# EAGLE design IO4-IR-Detector-Active-Mount (EAGLE 7.7.0)
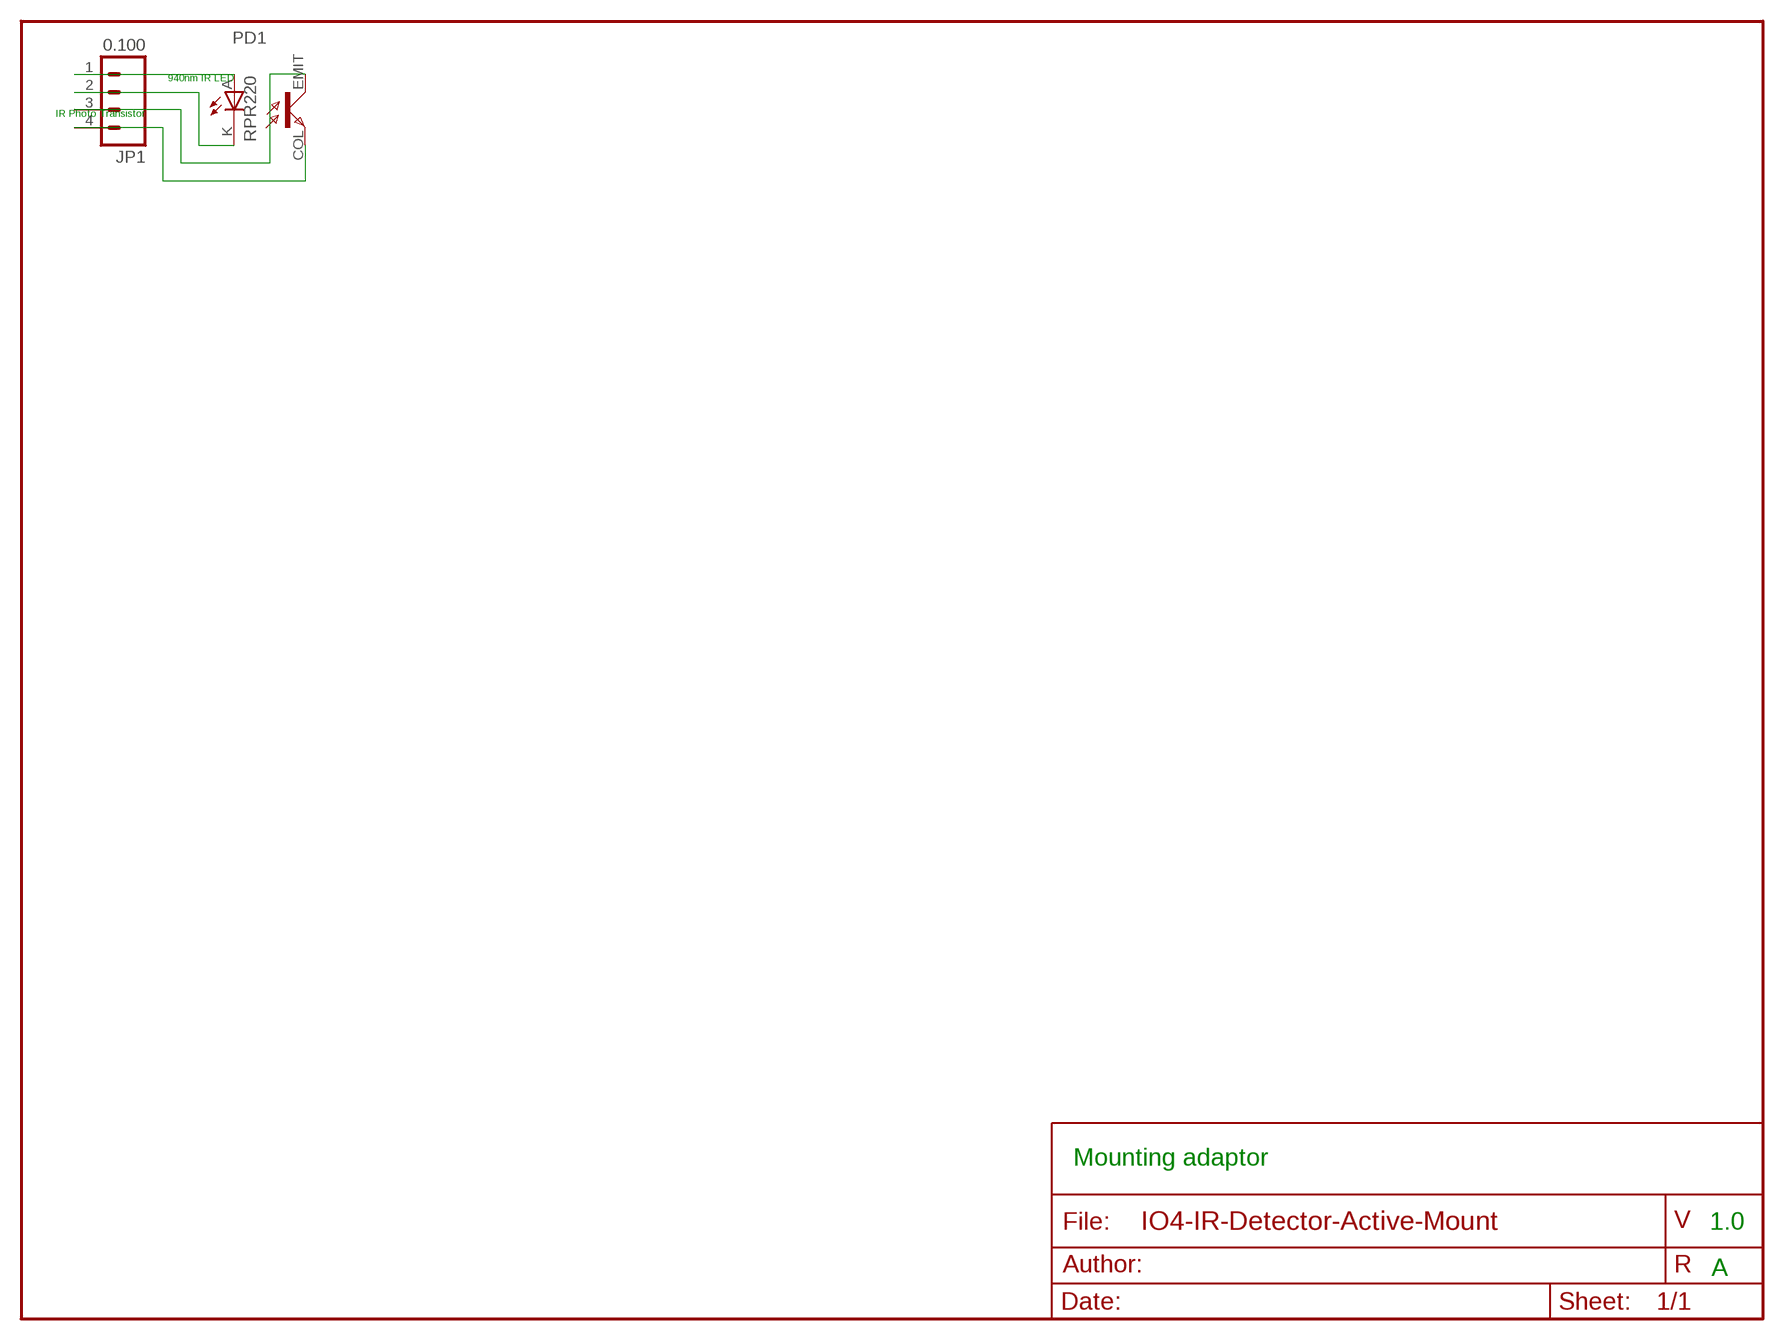
[diagram p0: schematic, sheet 1]

## Parts
JP1  0.100  CONNECTOR-M04LOCK  [1X04_LOCK]
PD1  RPR220  PHOTODETECTOR  [RPR220]

## Nets
N$1: JP1.2 PD1.K
N$2 [Power]: JP1.1 PD1.A
N$3: JP1.4 PD1.COL
N$4 [Power]: JP1.3 PD1.EMIT

## Notes on the sheet
- 940nm IR LED
- IR Photo Transistor
- Mounting adaptor
- 1.0
- A

## Library data of the parts
JP1 = SPCoast:CONNECTOR-M04: Header 4 Standard 4-pin 0.1" header. Use with straight break away headers (SKU : PRT-00116), right angle break away headers (PRT-00553), swiss pins (PRT-00743), machine pins (PRT-00117), and female headers (PRT-00115). Molex polarized connector foot print use with SKU : PRT-08231 with associated crimp pins and housings. 1MM SMD Version SKU: PRT-10208
PD1 = SPCoast:PHOTODETECTOR

## Net classes
0 default: width 0.254 mm
1 Power: width 0.406 mm, clearance 0.254 mm

## Board
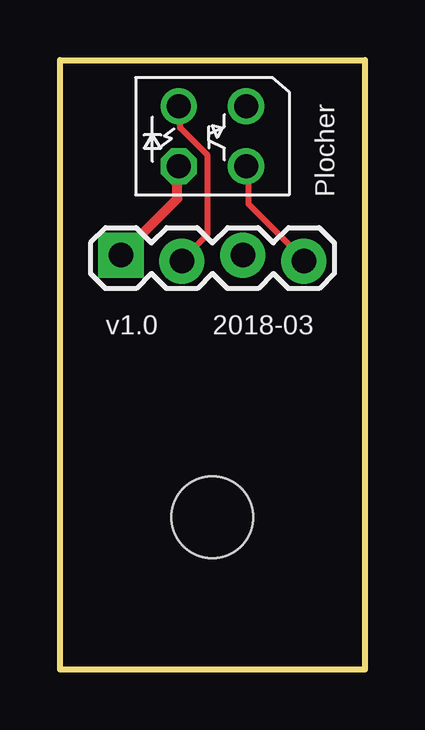
[diagram p1: board, top side]
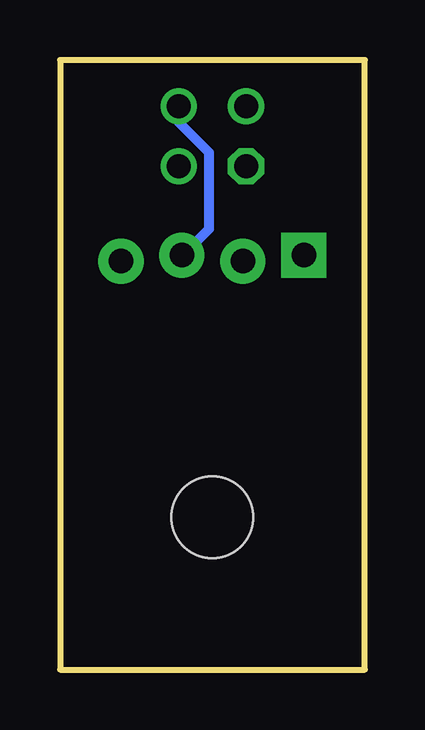
[diagram p2: board, bottom side, seen from below]

Size 12.7 x 25.4 mm. Coordinates in mm from the lower left corner, seen from the top.
Outline: 0,0 0,25.4 12.7,25.4 12.7,0 0,0
Copper layers (1*16): Top 0.035mm / dielectric 1.5mm / Bottom 0.035mm
Design rules "default": minimum track width 10mil, minimum drill 0.6mm, track to track 8mil, track to pad 8mil, pad to pad 8mil, via to via 8mil, smd to smd 8mil, copper to edge 40mil, drill to drill 8mil, minimum pad ring 10mil, minimum via ring 8mil, stop-mask expansion 4mil, vias tented up to drill 0mil, thermal gap 10mil
Holes 3.4 mm at 6.35,6.35

### Footprints (pad centres in the part's own frame; a part is rotated, then mirrored left to right if it is on the bottom)
1X04_LOCK = drill 1.016 pad 1.88 square: 1 0,0.127 | drill 1.016 pad 1.88: 2 2.54,-0.127; 3 5.08,0.127; 4 7.62,-0.127
RPR220 = drill 1 octagon: A -1.4,-1.25 | drill 1: COL 1.4,-1.25; EMIT 1.4,1.25; K -1.4,1.25

### Placement (x,y rotation side)
JP1  2.54,17.14 0 top
PD1  6.35,22.23 0 top

### Tracks (layer width: path | path; a pad name or v marks a point on that pad's centre or on a via)
N$1
  Top 0.254: PD1.K 5,23.37 5,22.57 6.15,21.43 6.15,18.14 5.12,17.11 JP1.2
N$2
  Top 0.406: JP1.1 4.89,19.62 4.89,20.97 PD1.A
N$3
  Top 0.254: PD1.COL 7.86,20.97 7.86,19.39 10.15,17.11 JP1.4
N$4
  Bottom 0.406: PD1.EMIT 7.75,23.37 7.75,22.8 6.49,21.54 6.49,18.36 7.52,17.34 JP1.3

### Text on the board
tPlace: Plocher | v1.0 | 2018-03